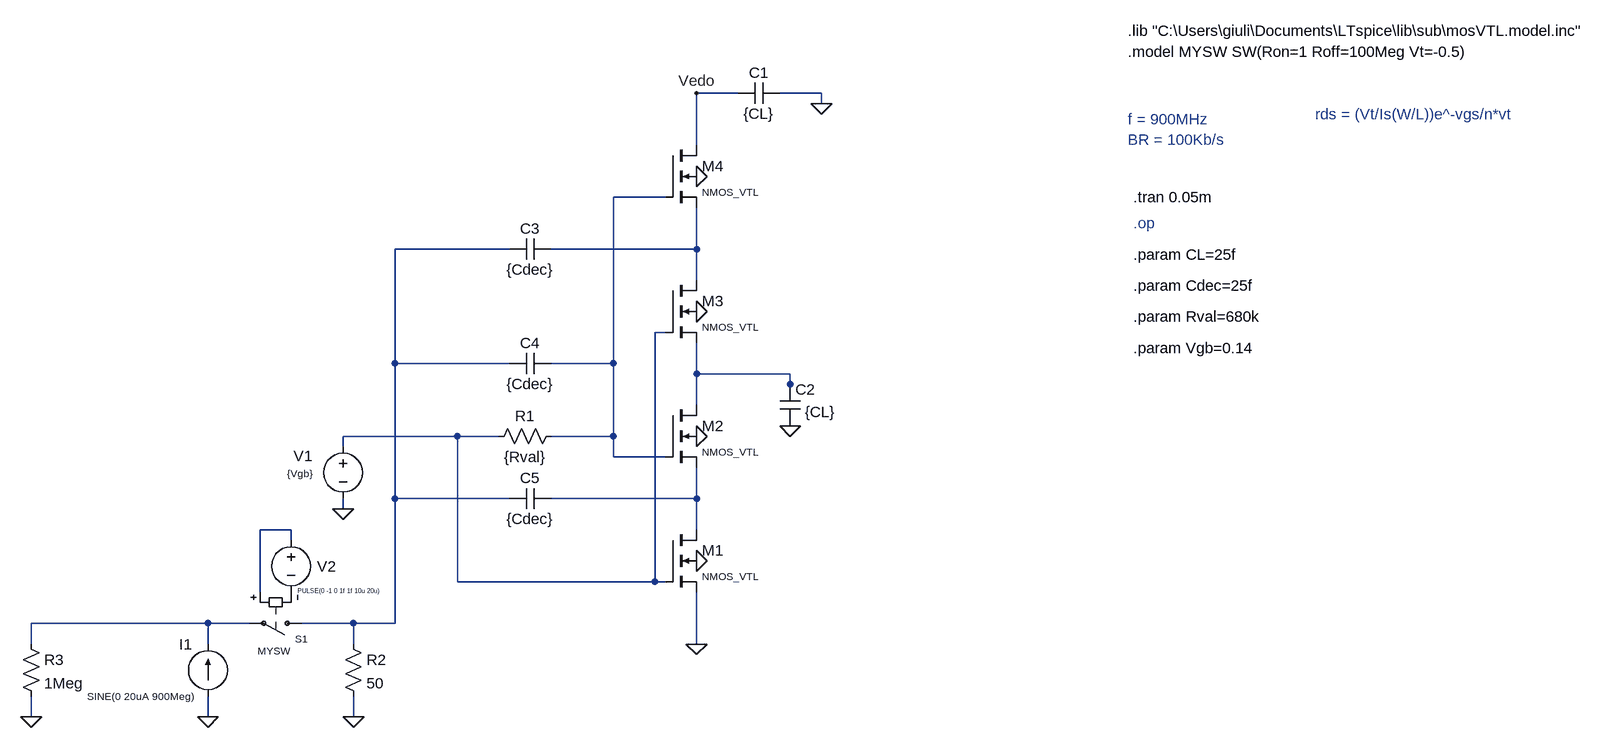
[diagram p0: schematic 1_envelope.asc]
1_envelope.asc, the LTspice schematic file:
Version 4
SHEET 1 1348 680
WIRE -48 -608 -112 -608
WIRE 80 -608 16 -608
WIRE 80 -592 80 -608
WIRE -112 -528 -112 -608
WIRE -160 -448 -240 -448
WIRE -400 -368 -576 -368
WIRE -112 -368 -112 -432
WIRE -112 -368 -336 -368
WIRE -112 -320 -112 -368
WIRE -160 -240 -176 -240
WIRE -576 -192 -576 -368
WIRE -400 -192 -576 -192
WIRE -240 -192 -240 -448
WIRE -240 -192 -336 -192
WIRE -112 -176 -112 -224
WIRE 32 -176 -112 -176
WIRE 32 -160 32 -176
WIRE 32 -144 32 -160
WIRE -112 -128 -112 -176
WIRE -480 -80 -656 -80
WIRE -416 -80 -480 -80
WIRE -240 -80 -240 -192
WIRE -240 -80 -336 -80
WIRE -656 -64 -656 -80
WIRE -240 -48 -240 -80
WIRE -160 -48 -240 -48
WIRE -576 16 -576 -192
WIRE -400 16 -576 16
WIRE -112 16 -112 -32
WIRE -112 16 -336 16
WIRE -656 32 -656 16
WIRE -736 64 -784 64
WIRE -112 64 -112 16
WIRE -736 80 -736 64
WIRE -480 144 -480 -80
WIRE -176 144 -176 -240
WIRE -176 144 -480 144
WIRE -160 144 -176 144
WIRE -784 160 -784 64
WIRE -864 208 -1136 208
WIRE -800 208 -864 208
WIRE -640 208 -720 208
WIRE -576 208 -576 16
WIRE -576 208 -640 208
WIRE -1136 240 -1136 208
WIRE -864 240 -864 208
WIRE -640 240 -640 208
WIRE -112 240 -112 160
WIRE -1136 352 -1136 320
WIRE -864 352 -864 320
WIRE -640 352 -640 320
FLAG -112 240 0
FLAG -112 -480 0
FLAG -112 -272 0
FLAG -112 -80 0
FLAG -112 112 0
FLAG 80 -592 0
FLAG 32 -96 0
FLAG -112 -608 Vedo
FLAG -656 32 0
FLAG -640 352 0
FLAG -864 352 0
FLAG -1136 352 0
SYMBOL nmos4 -160 64 R0
WINDOW 3 56 72 Left 1
SYMATTR Value NMOS_VTL
SYMATTR InstName M1
SYMATTR Value2 l=50n w=1u
SYMBOL nmos4 -160 -128 R0
WINDOW 3 56 72 Left 1
SYMATTR Value NMOS_VTL
SYMATTR InstName M2
SYMATTR Value2 l=50n w=1u
SYMBOL nmos4 -160 -320 R0
WINDOW 3 56 72 Left 1
SYMATTR Value NMOS_VTL
SYMATTR InstName M3
SYMATTR Value2 l=50n w=1u
SYMBOL nmos4 -160 -528 R0
WINDOW 3 56 72 Left 1
SYMATTR Value NMOS_VTL
SYMATTR InstName M4
SYMATTR Value2 l=50n w=1u
SYMBOL cap 16 -624 R90
WINDOW 0 0 32 VBottom 2
WINDOW 3 32 32 VTop 2
SYMATTR InstName C1
SYMATTR Value {CL}
SYMBOL cap 16 -160 R0
WINDOW 3 39 43 Left 2
SYMATTR Value {CL}
SYMATTR InstName C2
SYMBOL cap -336 -384 R90
WINDOW 0 0 32 VBottom 2
WINDOW 3 32 32 VTop 2
SYMATTR InstName C3
SYMATTR Value {Cdec}
SYMBOL cap -336 -208 R90
WINDOW 0 0 32 VBottom 2
WINDOW 3 32 32 VTop 2
SYMATTR InstName C4
SYMATTR Value {Cdec}
SYMBOL cap -336 0 R90
WINDOW 0 0 32 VBottom 2
WINDOW 3 32 32 VTop 2
SYMATTR InstName C5
SYMATTR Value {Cdec}
SYMBOL res -320 -96 R90
WINDOW 0 0 56 VBottom 2
WINDOW 3 32 56 VTop 2
SYMATTR InstName R1
SYMATTR Value {Rval}
SYMBOL voltage -656 -80 R0
WINDOW 0 -76 30 Left 2
WINDOW 3 -86 57 Left 1
SYMATTR InstName V1
SYMATTR Value {Vgb}
SYMBOL res -656 224 R0
SYMATTR InstName R2
SYMATTR Value 50
SYMBOL sw -704 208 R90
WINDOW 0 24 6 VRight 1
WINDOW 3 42 34 VRight 1
SYMATTR InstName S1
SYMATTR Value MYSW
SYMBOL current -864 320 R180
WINDOW 0 24 80 Left 2
WINDOW 3 24 0 Left 1
WINDOW 123 0 0 Left 0
WINDOW 39 0 0 Left 0
SYMATTR InstName I1
SYMATTR Value SINE(0 20uA 900Meg)
SYMBOL res -1152 224 R0
SYMATTR InstName R3
SYMATTR Value 1Meg
SYMBOL voltage -736 64 R0
WINDOW 3 10 94 Left 0
WINDOW 123 0 0 Left 0
WINDOW 39 0 0 Left 0
WINDOW 0 40 56 Left 2
SYMATTR Value PULSE(0 -1 0 1f 1f 10u 20u)
SYMATTR InstName V2
TEXT 552 -568 Left 2 ;f = 900MHz\nBR = 100Kb/s
TEXT 552 -704 Left 2 !.lib "C:\\Users\\giuli\\Documents\\LTspice\\lib\\sub\\mosVTL.model.inc"
TEXT 552 -672 Left 2 !.model MYSW SW(Ron=1 Roff=100Meg Vt=-0.5)
TEXT 560 -448 Left 2 !.tran 0.05m
TEXT 840 -576 Left 2 ;rds = (Vt/Is(W/L))e^-vgs/n*vt
TEXT 560 -408 Left 2 ;.op
TEXT 560 -360 Left 2 !.param CL=25f
TEXT 560 -312 Left 2 !.param Cdec=25f
TEXT 560 -264 Left 2 !.param Rval=680k
TEXT 560 -216 Left 2 !.param Vgb=0.14

The netlist it stands for:
* 1_envelope.asc
M1 N006 N004 0 0 NMOS_VTL l=50n w=1u
M2 N005 N001 N006 0 NMOS_VTL l=50n w=1u
M3 N003 N004 N005 0 NMOS_VTL l=50n w=1u
M4 Vedo N001 N003 0 NMOS_VTL l=50n w=1u
C1 0 Vedo {CL}
C2 N005 0 {CL}
C3 N003 N002 {Cdec}
C4 N001 N002 {Cdec}
C5 N006 N002 {Cdec}
R1 N001 N004 {Rval}
V1 N004 0 {Vgb}
R2 N002 0 50
S1 N002 N008 N007 P001 MYSW
I1 0 N008 SINE(0 20uA 900Meg)
R3 N008 0 1Meg
V2 N007 P001 PULSE(0 -1 0 1f 1f 10u 20u)
.model NMOS NMOS
.model PMOS PMOS
.lib standard.mos
* f = 900MHz
* BR = 100Kb/s
.lib "C:\Users\giuli\Documents\LTspice\lib\sub\mosVTL.model.inc"
.model MYSW SW(Ron=1 Roff=100Meg Vt=-0.5)
.tran 0.05m
* rds = (Vt/Is(W/L))e^-vgs/n*vt
* .op
.param CL=25f
.param Cdec=25f
.param Rval=680k
.param Vgb=0.14
.backanno
.end